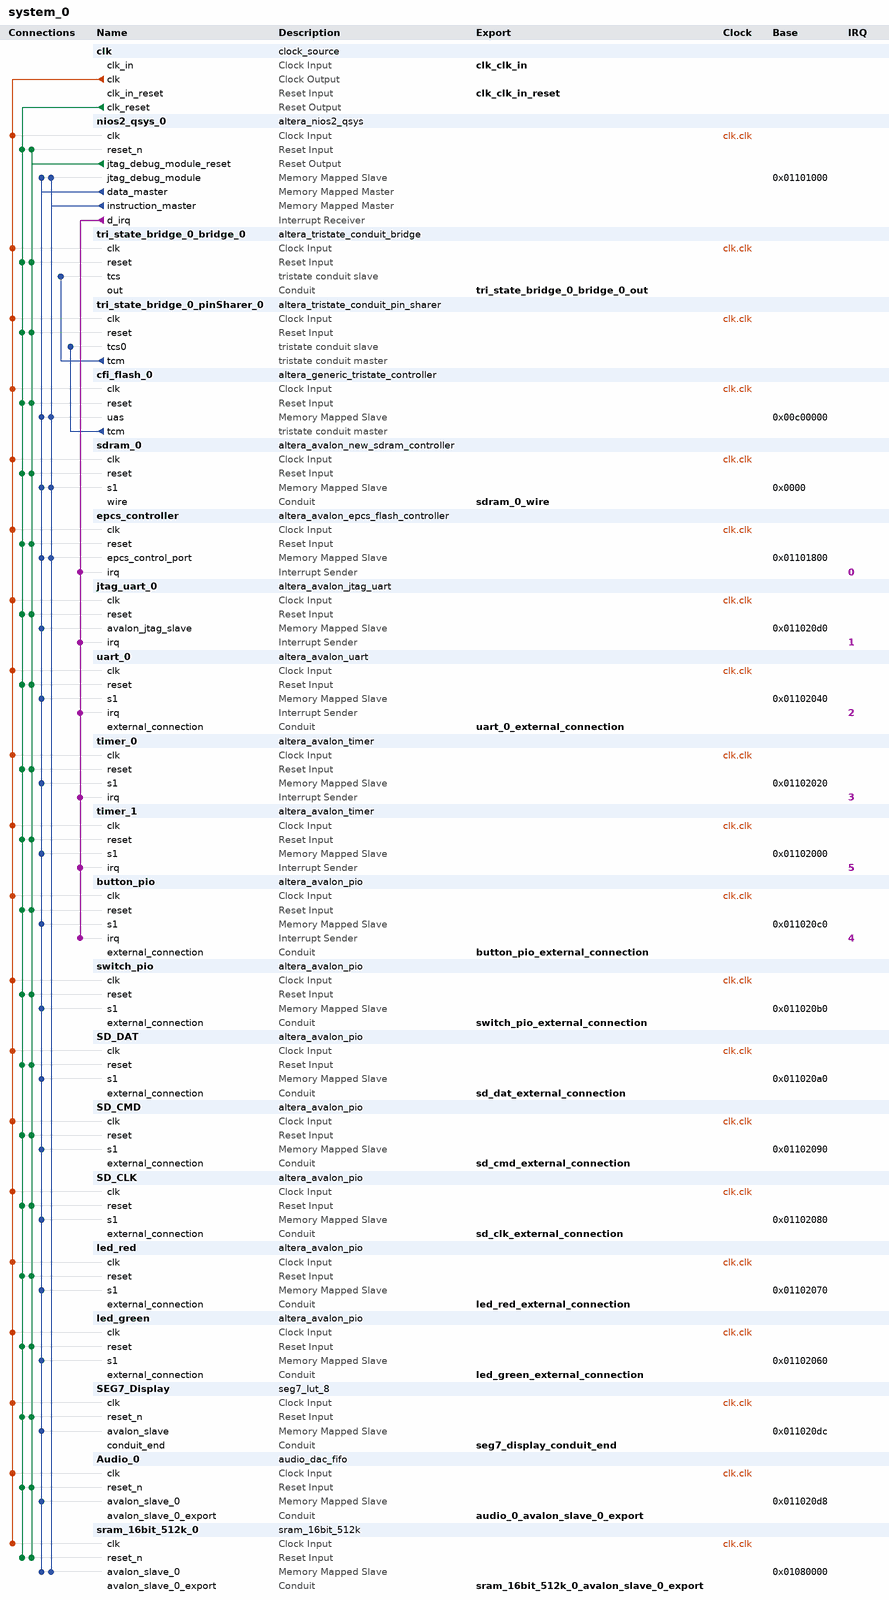
[diagram p0: system contents]
# Platform Designer (Qsys) system system_0, CYCLONEII EP2C20F484C7
# Parameters at their usual value, and those the tool derives, are not listed.
package require -exact qsys 11.1
create_system system_0
set_project_property DEVICE_FAMILY CYCLONEII
set_project_property DEVICE EP2C20F484C7

add_instance clk clock_source 11.1
set_instance_parameter_value clk clockFrequency 100000000

add_instance nios2_qsys_0 altera_nios2_qsys 11.1
set_instance_parameter_value nios2_qsys_0 resetSlave cfi_flash_0.uas
set_instance_parameter_value nios2_qsys_0 exceptionSlave sdram_0.s1
set_instance_parameter_value nios2_qsys_0 breakSlave nios2_qsys_0.jtag_debug_module
set_instance_parameter_value nios2_qsys_0 impl Fast
set_instance_parameter_value nios2_qsys_0 icache_size 4096

add_instance tri_state_bridge_0_bridge_0 altera_tristate_conduit_bridge 11.1

add_instance tri_state_bridge_0_pinSharer_0 altera_tristate_conduit_pin_sharer 11.1
set_instance_parameter_value tri_state_bridge_0_pinSharer_0 NUM_INTERFACES 1
set_instance_parameter_value tri_state_bridge_0_pinSharer_0 MODULE_ORIGIN_LIST cfi_flash_0.tcm,cfi_flash_0.tcm,cfi_flash_0.tcm,cfi_flash_0.tcm,cfi_flash_0.tcm
set_instance_parameter_value tri_state_bridge_0_pinSharer_0 SHARED_SIGNAL_LIST tri_state_bridge_0_address,tri_state_bridge_0_readn,write_n_to_the_cfi_flash_0,tri_state_bridge_0_data,select_n_to_the_cfi_flash_0

add_instance cfi_flash_0 altera_generic_tristate_controller 11.1
set_instance_parameter_value cfi_flash_0 TCM_ADDRESS_W 22
set_instance_parameter_value cfi_flash_0 TCM_DATA_W 8
set_instance_parameter_value cfi_flash_0 TCM_BYTEENABLE_W 1
set_instance_parameter_value cfi_flash_0 TCM_READ_WAIT 160
set_instance_parameter_value cfi_flash_0 TCM_WRITE_WAIT 160
set_instance_parameter_value cfi_flash_0 TCM_SETUP_WAIT 40
set_instance_parameter_value cfi_flash_0 TCM_DATA_HOLD 40
set_instance_parameter_value cfi_flash_0 TCM_MAX_PENDING_READ_TRANSACTIONS 3
set_instance_parameter_value cfi_flash_0 TCM_TURNAROUND_TIME 2
set_instance_parameter_value cfi_flash_0 TCM_TIMING_UNITS 0
set_instance_parameter_value cfi_flash_0 TCM_READLATENCY 2
set_instance_parameter_value cfi_flash_0 TCM_SYMBOLS_PER_WORD 1
set_instance_parameter_value cfi_flash_0 USE_READ 1
set_instance_parameter_value cfi_flash_0 USE_BEGINTRANSFER 0
set_instance_parameter_value cfi_flash_0 USE_BYTEENABLE 0
set_instance_parameter_value cfi_flash_0 USE_OUTPUTENABLE 0
set_instance_parameter_value cfi_flash_0 ACTIVE_LOW_READ 1
set_instance_parameter_value cfi_flash_0 ACTIVE_LOW_BYTEENABLE 0
set_instance_parameter_value cfi_flash_0 ACTIVE_LOW_OUTPUTENABLE 0
set_instance_parameter_value cfi_flash_0 ACTIVE_LOW_BEGINTRANSFER 0
set_instance_parameter_value cfi_flash_0 CHIPSELECT_THROUGH_READLATENCY 0
set_instance_parameter_value cfi_flash_0 MODULE_ASSIGNMENT_KEYS embeddedsw.configuration.hwClassnameDriverSupportList,embeddedsw.configuration.hwClassnameDriverSupportDefault,embeddedsw.CMacro.SETUP_VALUE,embeddedsw.CMacro.WAIT_VALUE,embeddedsw.CMacro.HOLD_VALUE,embeddedsw.CMacro.TIMING_UNITS,embeddedsw.CMacro.SIZE,embeddedsw.memoryInfo.MEM_INIT_DATA_WIDTH,embeddedsw.memoryInfo.HAS_BYTE_LANE,embeddedsw.memoryInfo.IS_FLASH,embeddedsw.memoryInfo.GENERATE_DAT_SYM,embeddedsw.memoryInfo.GENERATE_FLASH,embeddedsw.memoryInfo.DAT_SYM_INSTALL_DIR,embeddedsw.memoryInfo.FLASH_INSTALL_DIR
set_instance_parameter_value cfi_flash_0 MODULE_ASSIGNMENT_VALUES {altera_avalon_lan91c111:altera_avalon_cfi_flash,altera_avalon_cfi_flash,40,160,40,"ns",4194304u,8,0,1,1,1,SIM_DIR,APP_DIR}
set_instance_parameter_value cfi_flash_0 INTERFACE_ASSIGNMENT_KEYS embeddedsw.configuration.isFlash,embeddedsw.configuration.isMemoryDevice,embeddedsw.configuration.isNonVolatileStorage
set_instance_parameter_value cfi_flash_0 INTERFACE_ASSIGNMENT_VALUES 1,1,1

add_instance sdram_0 altera_avalon_new_sdram_controller 11.1
set_instance_parameter_value sdram_0 TAC 5.5
set_instance_parameter_value sdram_0 TRCD 20.0
set_instance_parameter_value sdram_0 TRP 20.0
set_instance_parameter_value sdram_0 casLatency 3
set_instance_parameter_value sdram_0 columnWidth 8
set_instance_parameter_value sdram_0 dataWidth 16
set_instance_parameter_value sdram_0 generateSimulationModel true
set_instance_parameter_value sdram_0 model custom
set_instance_parameter_value sdram_0 numberOfBanks 4
set_instance_parameter_value sdram_0 numberOfChipSelects 1
set_instance_parameter_value sdram_0 powerUpDelay 100.0
set_instance_parameter_value sdram_0 refreshPeriod 15.625
set_instance_parameter_value sdram_0 rowWidth 12

add_instance epcs_controller altera_avalon_epcs_flash_controller 11.1
set_instance_parameter_value epcs_controller useASMIAtom true

add_instance jtag_uart_0 altera_avalon_jtag_uart 11.1
set_instance_parameter_value jtag_uart_0 simInteractiveOptions INTERACTIVE_ASCII_OUTPUT

add_instance uart_0 altera_avalon_uart 11.1
set_instance_parameter_value uart_0 baud 115200
set_instance_parameter_value uart_0 dataBits 8
set_instance_parameter_value uart_0 fixedBaud true
set_instance_parameter_value uart_0 parity NONE
set_instance_parameter_value uart_0 stopBits 1

add_instance timer_0 altera_avalon_timer 11.1
set_instance_parameter_value timer_0 period 1
set_instance_parameter_value timer_0 periodUnits MSEC
set_instance_parameter_value timer_0 timerPreset CUSTOM

add_instance timer_1 altera_avalon_timer 11.1
set_instance_parameter_value timer_1 period 1
set_instance_parameter_value timer_1 periodUnits MSEC
set_instance_parameter_value timer_1 timerPreset CUSTOM

add_instance button_pio altera_avalon_pio 11.1
set_instance_parameter_value button_pio captureEdge true
set_instance_parameter_value button_pio direction Input
set_instance_parameter_value button_pio edgeType FALLING
set_instance_parameter_value button_pio generateIRQ true
set_instance_parameter_value button_pio irqType EDGE
set_instance_parameter_value button_pio simDoTestBenchWiring true
set_instance_parameter_value button_pio width 4

add_instance switch_pio altera_avalon_pio 11.1
set_instance_parameter_value switch_pio direction Input
set_instance_parameter_value switch_pio simDoTestBenchWiring true
set_instance_parameter_value switch_pio width 18

add_instance SD_DAT altera_avalon_pio 11.1
set_instance_parameter_value SD_DAT direction Bidir
set_instance_parameter_value SD_DAT simDoTestBenchWiring true
set_instance_parameter_value SD_DAT width 1

add_instance SD_CMD altera_avalon_pio 11.1
set_instance_parameter_value SD_CMD direction Bidir
set_instance_parameter_value SD_CMD simDoTestBenchWiring true
set_instance_parameter_value SD_CMD width 1

add_instance SD_CLK altera_avalon_pio 11.1
set_instance_parameter_value SD_CLK direction Output
set_instance_parameter_value SD_CLK width 1

add_instance led_red altera_avalon_pio 11.1
set_instance_parameter_value led_red direction Output
set_instance_parameter_value led_red width 10

add_instance led_green altera_avalon_pio 11.1
set_instance_parameter_value led_green direction Output
set_instance_parameter_value led_green width 8

add_instance SEG7_Display seg7_lut_8 1.0.1

add_instance Audio_0 audio_dac_fifo 1.0.2
set_instance_parameter_value Audio_0 REF_CLK 18432000
set_instance_parameter_value Audio_0 SAMPLE_RATE 48000
set_instance_parameter_value Audio_0 DATA_WIDTH 16
set_instance_parameter_value Audio_0 CHANNEL_NUM 2

add_instance sram_16bit_512k_0 sram_16bit_512k 1.0.2

# connections
add_connection clk.clk Audio_0.clk clock
add_connection clk.clk button_pio.clk clock
add_connection clk.clk cfi_flash_0.clk clock
add_connection clk.clk epcs_controller.clk clock
add_connection clk.clk jtag_uart_0.clk clock
add_connection clk.clk led_green.clk clock
add_connection clk.clk led_red.clk clock
add_connection clk.clk nios2_qsys_0.clk clock
add_connection clk.clk SD_CLK.clk clock
add_connection clk.clk SD_CMD.clk clock
add_connection clk.clk SD_DAT.clk clock
add_connection clk.clk sdram_0.clk clock
add_connection clk.clk SEG7_Display.clk clock
add_connection clk.clk sram_16bit_512k_0.clk clock
add_connection clk.clk switch_pio.clk clock
add_connection clk.clk timer_0.clk clock
add_connection clk.clk timer_1.clk clock
add_connection clk.clk tri_state_bridge_0_bridge_0.clk clock
add_connection clk.clk tri_state_bridge_0_pinSharer_0.clk clock
add_connection clk.clk uart_0.clk clock
add_connection clk.clk_reset Audio_0.reset_n reset
add_connection clk.clk_reset button_pio.reset reset
add_connection clk.clk_reset cfi_flash_0.reset reset
add_connection clk.clk_reset epcs_controller.reset reset
add_connection clk.clk_reset jtag_uart_0.reset reset
add_connection clk.clk_reset led_green.reset reset
add_connection clk.clk_reset led_red.reset reset
add_connection clk.clk_reset nios2_qsys_0.reset_n reset
add_connection clk.clk_reset SD_CLK.reset reset
add_connection clk.clk_reset SD_CMD.reset reset
add_connection clk.clk_reset SD_DAT.reset reset
add_connection clk.clk_reset sdram_0.reset reset
add_connection clk.clk_reset SEG7_Display.reset_n reset
add_connection clk.clk_reset sram_16bit_512k_0.reset_n reset
add_connection clk.clk_reset switch_pio.reset reset
add_connection clk.clk_reset timer_0.reset reset
add_connection clk.clk_reset timer_1.reset reset
add_connection clk.clk_reset tri_state_bridge_0_bridge_0.reset reset
add_connection clk.clk_reset tri_state_bridge_0_pinSharer_0.reset reset
add_connection clk.clk_reset uart_0.reset reset
add_connection nios2_qsys_0.jtag_debug_module_reset Audio_0.reset_n reset
add_connection nios2_qsys_0.jtag_debug_module_reset button_pio.reset reset
add_connection nios2_qsys_0.jtag_debug_module_reset cfi_flash_0.reset reset
add_connection nios2_qsys_0.jtag_debug_module_reset epcs_controller.reset reset
add_connection nios2_qsys_0.jtag_debug_module_reset jtag_uart_0.reset reset
add_connection nios2_qsys_0.jtag_debug_module_reset led_green.reset reset
add_connection nios2_qsys_0.jtag_debug_module_reset led_red.reset reset
add_connection nios2_qsys_0.jtag_debug_module_reset nios2_qsys_0.reset_n reset
add_connection nios2_qsys_0.jtag_debug_module_reset SD_CLK.reset reset
add_connection nios2_qsys_0.jtag_debug_module_reset SD_CMD.reset reset
add_connection nios2_qsys_0.jtag_debug_module_reset SD_DAT.reset reset
add_connection nios2_qsys_0.jtag_debug_module_reset sdram_0.reset reset
add_connection nios2_qsys_0.jtag_debug_module_reset SEG7_Display.reset_n reset
add_connection nios2_qsys_0.jtag_debug_module_reset sram_16bit_512k_0.reset_n reset
add_connection nios2_qsys_0.jtag_debug_module_reset switch_pio.reset reset
add_connection nios2_qsys_0.jtag_debug_module_reset timer_0.reset reset
add_connection nios2_qsys_0.jtag_debug_module_reset timer_1.reset reset
add_connection nios2_qsys_0.jtag_debug_module_reset tri_state_bridge_0_bridge_0.reset reset
add_connection nios2_qsys_0.jtag_debug_module_reset tri_state_bridge_0_pinSharer_0.reset reset
add_connection nios2_qsys_0.jtag_debug_module_reset uart_0.reset reset
add_connection nios2_qsys_0.data_master Audio_0.avalon_slave_0 avalon
set_connection_parameter_value nios2_qsys_0.data_master/Audio_0.avalon_slave_0 baseAddress 0x011020d8
add_connection nios2_qsys_0.data_master button_pio.s1 avalon
set_connection_parameter_value nios2_qsys_0.data_master/button_pio.s1 baseAddress 0x011020c0
add_connection nios2_qsys_0.data_master cfi_flash_0.uas avalon
set_connection_parameter_value nios2_qsys_0.data_master/cfi_flash_0.uas baseAddress 0x00c00000
add_connection nios2_qsys_0.data_master epcs_controller.epcs_control_port avalon
set_connection_parameter_value nios2_qsys_0.data_master/epcs_controller.epcs_control_port baseAddress 0x01101800
add_connection nios2_qsys_0.data_master jtag_uart_0.avalon_jtag_slave avalon
set_connection_parameter_value nios2_qsys_0.data_master/jtag_uart_0.avalon_jtag_slave baseAddress 0x011020d0
add_connection nios2_qsys_0.data_master led_green.s1 avalon
set_connection_parameter_value nios2_qsys_0.data_master/led_green.s1 baseAddress 0x01102060
add_connection nios2_qsys_0.data_master led_red.s1 avalon
set_connection_parameter_value nios2_qsys_0.data_master/led_red.s1 baseAddress 0x01102070
add_connection nios2_qsys_0.data_master nios2_qsys_0.jtag_debug_module avalon
set_connection_parameter_value nios2_qsys_0.data_master/nios2_qsys_0.jtag_debug_module baseAddress 0x01101000
add_connection nios2_qsys_0.data_master SD_CLK.s1 avalon
set_connection_parameter_value nios2_qsys_0.data_master/SD_CLK.s1 baseAddress 0x01102080
add_connection nios2_qsys_0.data_master SD_CMD.s1 avalon
set_connection_parameter_value nios2_qsys_0.data_master/SD_CMD.s1 baseAddress 0x01102090
add_connection nios2_qsys_0.data_master SD_DAT.s1 avalon
set_connection_parameter_value nios2_qsys_0.data_master/SD_DAT.s1 baseAddress 0x011020a0
add_connection nios2_qsys_0.data_master sdram_0.s1 avalon
set_connection_parameter_value nios2_qsys_0.data_master/sdram_0.s1 baseAddress 0x0000
add_connection nios2_qsys_0.data_master SEG7_Display.avalon_slave avalon
set_connection_parameter_value nios2_qsys_0.data_master/SEG7_Display.avalon_slave baseAddress 0x011020dc
add_connection nios2_qsys_0.data_master sram_16bit_512k_0.avalon_slave_0 avalon
set_connection_parameter_value nios2_qsys_0.data_master/sram_16bit_512k_0.avalon_slave_0 baseAddress 0x01080000
add_connection nios2_qsys_0.data_master switch_pio.s1 avalon
set_connection_parameter_value nios2_qsys_0.data_master/switch_pio.s1 baseAddress 0x011020b0
add_connection nios2_qsys_0.data_master timer_0.s1 avalon
set_connection_parameter_value nios2_qsys_0.data_master/timer_0.s1 baseAddress 0x01102020
add_connection nios2_qsys_0.data_master timer_1.s1 avalon
set_connection_parameter_value nios2_qsys_0.data_master/timer_1.s1 baseAddress 0x01102000
add_connection nios2_qsys_0.data_master uart_0.s1 avalon
set_connection_parameter_value nios2_qsys_0.data_master/uart_0.s1 baseAddress 0x01102040
add_connection nios2_qsys_0.instruction_master cfi_flash_0.uas avalon
set_connection_parameter_value nios2_qsys_0.instruction_master/cfi_flash_0.uas baseAddress 0x00c00000
add_connection nios2_qsys_0.instruction_master epcs_controller.epcs_control_port avalon
set_connection_parameter_value nios2_qsys_0.instruction_master/epcs_controller.epcs_control_port baseAddress 0x01101800
add_connection nios2_qsys_0.instruction_master nios2_qsys_0.jtag_debug_module avalon
set_connection_parameter_value nios2_qsys_0.instruction_master/nios2_qsys_0.jtag_debug_module baseAddress 0x01101000
add_connection nios2_qsys_0.instruction_master sdram_0.s1 avalon
set_connection_parameter_value nios2_qsys_0.instruction_master/sdram_0.s1 baseAddress 0x0000
add_connection nios2_qsys_0.instruction_master sram_16bit_512k_0.avalon_slave_0 avalon
set_connection_parameter_value nios2_qsys_0.instruction_master/sram_16bit_512k_0.avalon_slave_0 baseAddress 0x01080000
add_connection nios2_qsys_0.d_irq button_pio.irq interrupt
set_connection_parameter_value nios2_qsys_0.d_irq/button_pio.irq irqNumber 4
add_connection nios2_qsys_0.d_irq epcs_controller.irq interrupt
set_connection_parameter_value nios2_qsys_0.d_irq/epcs_controller.irq irqNumber 0
add_connection nios2_qsys_0.d_irq jtag_uart_0.irq interrupt
set_connection_parameter_value nios2_qsys_0.d_irq/jtag_uart_0.irq irqNumber 1
add_connection nios2_qsys_0.d_irq timer_0.irq interrupt
set_connection_parameter_value nios2_qsys_0.d_irq/timer_0.irq irqNumber 3
add_connection nios2_qsys_0.d_irq timer_1.irq interrupt
set_connection_parameter_value nios2_qsys_0.d_irq/timer_1.irq irqNumber 5
add_connection nios2_qsys_0.d_irq uart_0.irq interrupt
set_connection_parameter_value nios2_qsys_0.d_irq/uart_0.irq irqNumber 2
add_connection cfi_flash_0.tcm tri_state_bridge_0_pinSharer_0.tcs0 tristate_conduit
add_connection tri_state_bridge_0_pinSharer_0.tcm tri_state_bridge_0_bridge_0.tcs tristate_conduit

# exported interfaces
add_interface button_pio_external_connection conduit end
set_interface_property button_pio_external_connection EXPORT_OF button_pio.external_connection
add_interface clk_clk_in clock sink
set_interface_property clk_clk_in EXPORT_OF clk.clk_in
add_interface switch_pio_external_connection conduit end
set_interface_property switch_pio_external_connection EXPORT_OF switch_pio.external_connection
add_interface sd_dat_external_connection conduit end
set_interface_property sd_dat_external_connection EXPORT_OF SD_DAT.external_connection
add_interface sd_cmd_external_connection conduit end
set_interface_property sd_cmd_external_connection EXPORT_OF SD_CMD.external_connection
add_interface sd_clk_external_connection conduit end
set_interface_property sd_clk_external_connection EXPORT_OF SD_CLK.external_connection
add_interface tri_state_bridge_0_bridge_0_out conduit end
set_interface_property tri_state_bridge_0_bridge_0_out EXPORT_OF tri_state_bridge_0_bridge_0.out
add_interface clk_clk_in_reset reset sink
set_interface_property clk_clk_in_reset EXPORT_OF clk.clk_in_reset
add_interface sdram_0_wire conduit end
set_interface_property sdram_0_wire EXPORT_OF sdram_0.wire
add_interface uart_0_external_connection conduit end
set_interface_property uart_0_external_connection EXPORT_OF uart_0.external_connection
add_interface led_red_external_connection conduit end
set_interface_property led_red_external_connection EXPORT_OF led_red.external_connection
add_interface led_green_external_connection conduit end
set_interface_property led_green_external_connection EXPORT_OF led_green.external_connection
add_interface seg7_display_conduit_end conduit end
set_interface_property seg7_display_conduit_end EXPORT_OF SEG7_Display.conduit_end
add_interface audio_0_avalon_slave_0_export conduit end
set_interface_property audio_0_avalon_slave_0_export EXPORT_OF Audio_0.avalon_slave_0_export
add_interface sram_16bit_512k_0_avalon_slave_0_export conduit end
set_interface_property sram_16bit_512k_0_avalon_slave_0_export EXPORT_OF sram_16bit_512k_0.avalon_slave_0_export

save_system system_0.qsys
